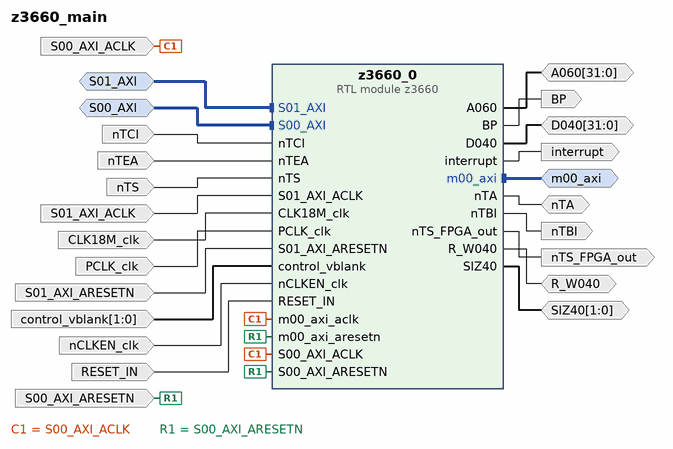
[diagram p0: block diagram of the top level]
# Vivado block design z3660_main, xc7z020clg400-1, Vivado 2023.2
create_bd_design z3660_main

create_bd_intf_port -mode Slave -vlnv xilinx.com:interface:aximm_rtl:1.0 S00_AXI
set_property -dict [list \
  CONFIG.ADDR_WIDTH 32 \
  CONFIG.ARUSER_WIDTH 0 \
  CONFIG.AWUSER_WIDTH 0 \
  CONFIG.BUSER_WIDTH 0 \
  CONFIG.DATA_WIDTH 32 \
  CONFIG.FREQ_HZ 200000000 \
  CONFIG.HAS_BRESP 1 \
  CONFIG.HAS_BURST 0 \
  CONFIG.HAS_CACHE 0 \
  CONFIG.HAS_LOCK 0 \
  CONFIG.HAS_PROT 1 \
  CONFIG.HAS_QOS 0 \
  CONFIG.HAS_REGION 0 \
  CONFIG.HAS_RRESP 1 \
  CONFIG.HAS_WSTRB 1 \
  CONFIG.ID_WIDTH 0 \
  CONFIG.MAX_BURST_LENGTH 1 \
  CONFIG.NUM_READ_OUTSTANDING 1 \
  CONFIG.NUM_READ_THREADS 4 \
  CONFIG.NUM_WRITE_OUTSTANDING 1 \
  CONFIG.NUM_WRITE_THREADS 4 \
  CONFIG.PROTOCOL AXI4LITE \
  CONFIG.READ_WRITE_MODE READ_WRITE \
  CONFIG.RUSER_BITS_PER_BYTE 0 \
  CONFIG.RUSER_WIDTH 0 \
  CONFIG.SUPPORTS_NARROW_BURST 0 \
  CONFIG.WUSER_BITS_PER_BYTE 0 \
  CONFIG.WUSER_WIDTH 0 \
] [get_bd_intf_ports S00_AXI]
create_bd_intf_port -mode Slave -vlnv xilinx.com:interface:aximm_rtl:1.0 S01_AXI
set_property -dict [list \
  CONFIG.ADDR_WIDTH 31 \
  CONFIG.ARUSER_WIDTH 0 \
  CONFIG.AWUSER_WIDTH 0 \
  CONFIG.BUSER_WIDTH 0 \
  CONFIG.DATA_WIDTH 32 \
  CONFIG.HAS_BRESP 1 \
  CONFIG.HAS_BURST 0 \
  CONFIG.HAS_CACHE 0 \
  CONFIG.HAS_LOCK 0 \
  CONFIG.HAS_PROT 1 \
  CONFIG.HAS_QOS 0 \
  CONFIG.HAS_REGION 0 \
  CONFIG.HAS_RRESP 1 \
  CONFIG.HAS_WSTRB 1 \
  CONFIG.ID_WIDTH 0 \
  CONFIG.MAX_BURST_LENGTH 1 \
  CONFIG.NUM_READ_OUTSTANDING 1 \
  CONFIG.NUM_READ_THREADS 1 \
  CONFIG.NUM_WRITE_OUTSTANDING 1 \
  CONFIG.NUM_WRITE_THREADS 1 \
  CONFIG.PHASE 0.000 \
  CONFIG.PROTOCOL AXI4LITE \
  CONFIG.READ_WRITE_MODE READ_WRITE \
  CONFIG.RUSER_BITS_PER_BYTE 0 \
  CONFIG.RUSER_WIDTH 0 \
  CONFIG.SUPPORTS_NARROW_BURST 0 \
  CONFIG.WUSER_BITS_PER_BYTE 0 \
  CONFIG.WUSER_WIDTH 0 \
] [get_bd_intf_ports S01_AXI]
create_bd_intf_port -mode Master -vlnv xilinx.com:interface:aximm_rtl:1.0 m00_axi
set_property -dict [list \
  CONFIG.ADDR_WIDTH 32 \
  CONFIG.DATA_WIDTH 32 \
  CONFIG.FREQ_HZ 200000000 \
  CONFIG.HAS_QOS 0 \
  CONFIG.HAS_REGION 0 \
  CONFIG.NUM_READ_OUTSTANDING 2 \
  CONFIG.NUM_WRITE_OUTSTANDING 2 \
  CONFIG.PROTOCOL AXI3 \
] [get_bd_intf_ports m00_axi]
create_bd_port -dir IO -from 31 -to 0 A060
create_bd_port -dir O BP
create_bd_port -dir I CLK18M_clk
create_bd_port -dir IO -from 31 -to 0 D040
create_bd_port -dir I -type clk PCLK_clk
set_property -dict {CONFIG.PHASE 30.0} [get_bd_ports PCLK_clk]
create_bd_port -dir I -type rst RESET_IN
set_property -dict {CONFIG.POLARITY ACTIVE_HIGH} [get_bd_ports RESET_IN]
create_bd_port -dir IO R_W040
create_bd_port -dir I -type clk S00_AXI_ACLK
set_property -dict [list \
  CONFIG.ASSOCIATED_BUSIF S00_AXI:m00_axi \
  CONFIG.ASSOCIATED_RESET S00_AXI_ARESETN \
  CONFIG.FREQ_HZ 200000000 \
] [get_bd_ports S00_AXI_ACLK]
create_bd_port -dir I -type rst S00_AXI_ARESETN
create_bd_port -dir I -type clk S01_AXI_ACLK
set_property -dict [list \
  CONFIG.ASSOCIATED_BUSIF S01_AXI \
  CONFIG.ASSOCIATED_RESET S01_AXI_ARESETN \
  CONFIG.PHASE 0.000 \
] [get_bd_ports S01_AXI_ACLK]
create_bd_port -dir I -type rst S01_AXI_ARESETN
create_bd_port -dir IO -from 1 -to 0 SIZ40
create_bd_port -dir I -from 1 -to 0 control_vblank
create_bd_port -dir O -type intr interrupt
create_bd_port -dir I -type clk nCLKEN_clk
set_property -dict {CONFIG.FREQ_HZ 50000000 CONFIG.PHASE 60.0} [get_bd_ports nCLKEN_clk]
create_bd_port -dir IO nTA
create_bd_port -dir O nTBI
create_bd_port -dir I nTCI
create_bd_port -dir I nTEA
create_bd_port -dir I nTS
create_bd_port -dir O nTS_FPGA_out

create_bd_cell -type module -reference z3660 z3660_0

# ---- connections ----

connect_bd_intf_net -intf_net processing_av_system_0_M_AXI [get_bd_intf_ports S01_AXI] [get_bd_intf_pins z3660_0/S01_AXI]
connect_bd_intf_net -intf_net processing_av_system_0_M_AXI1 [get_bd_intf_ports S00_AXI] [get_bd_intf_pins z3660_0/S00_AXI]
connect_bd_intf_net [get_bd_intf_ports m00_axi] [get_bd_intf_pins z3660_0/m00_axi]
connect_bd_net [get_bd_ports SIZ40] [get_bd_pins z3660_0/SIZ40]
connect_bd_net [get_bd_ports D040] [get_bd_pins z3660_0/D040]
connect_bd_net [get_bd_ports A060] [get_bd_pins z3660_0/A060]
connect_bd_net [get_bd_ports R_W040] [get_bd_pins z3660_0/R_W040]
connect_bd_net [get_bd_ports nTA] [get_bd_pins z3660_0/nTA]
connect_bd_net -net amiga_0_nTCI [get_bd_ports nTCI] [get_bd_pins z3660_0/nTCI]
connect_bd_net -net amiga_0_nTEA [get_bd_ports nTEA] [get_bd_pins z3660_0/nTEA]
connect_bd_net -net amiga_0_nTS_out [get_bd_ports nTS] [get_bd_pins z3660_0/nTS]
connect_bd_net -net processing_av_system_0_AXI_clk [get_bd_ports S01_AXI_ACLK] [get_bd_pins z3660_0/S01_AXI_ACLK]
connect_bd_net -net processing_av_system_0_CLK18M_clk [get_bd_ports CLK18M_clk] [get_bd_pins z3660_0/CLK18M_clk]
connect_bd_net -net processing_av_system_0_PCLK_reg [get_bd_ports PCLK_clk] [get_bd_pins z3660_0/PCLK_clk]
connect_bd_net -net processing_av_system_0_aresetn [get_bd_ports S01_AXI_ARESETN] [get_bd_pins z3660_0/S01_AXI_ARESETN]
connect_bd_net -net processing_av_system_0_control_vblank [get_bd_ports control_vblank] [get_bd_pins z3660_0/control_vblank]
connect_bd_net -net processing_av_system_0_nCLKEN_reg [get_bd_ports nCLKEN_clk] [get_bd_pins z3660_0/nCLKEN_clk]
connect_bd_net -net processing_av_system_0_peripheral_reset [get_bd_ports RESET_IN] [get_bd_pins z3660_0/RESET_IN]
connect_bd_net -net processing_av_system_AXI1_clk [get_bd_ports S00_AXI_ACLK] [get_bd_pins z3660_0/S00_AXI_ACLK] [get_bd_pins z3660_0/m00_axi_aclk]
connect_bd_net -net processing_av_system_aresetn1 [get_bd_ports S00_AXI_ARESETN] \
  [get_bd_pins z3660_0/S00_AXI_ARESETN] [get_bd_pins z3660_0/m00_axi_aresetn]
connect_bd_net [get_bd_pins z3660_0/BP] [get_bd_ports BP]
connect_bd_net [get_bd_pins z3660_0/interrupt] [get_bd_ports interrupt]
connect_bd_net [get_bd_pins z3660_0/nTBI] [get_bd_ports nTBI]
connect_bd_net [get_bd_pins z3660_0/nTS_FPGA_out] [get_bd_ports nTS_FPGA_out]

# ---- address map ----
assign_bd_address -offset 0x80000000 -range 512M -target_address_space [get_bd_addr_spaces S00_AXI] [get_bd_addr_segs z3660_0/S00_AXI/reg0]
assign_bd_address -offset 0x7FC70000 -range 4K -target_address_space [get_bd_addr_spaces S01_AXI] [get_bd_addr_segs z3660_0/S01_AXI/reg0]
assign_bd_address -offset 0x20000000 -range 512M -target_address_space [get_bd_addr_spaces z3660_0/m00_axi] [get_bd_addr_segs m00_axi/Reg]
assign_bd_address -offset 0x40000000 -range 1G -target_address_space [get_bd_addr_spaces z3660_0/m00_axi] [get_bd_addr_segs m00_axi/Reg]
assign_bd_address -offset 0x80000000 -range 1G -target_address_space [get_bd_addr_spaces z3660_0/m00_axi] [get_bd_addr_segs m00_axi/Reg]
assign_bd_address -offset 0xE0000000 -range 4M -target_address_space [get_bd_addr_spaces z3660_0/m00_axi] [get_bd_addr_segs m00_axi/Reg]

validate_bd_design
save_bd_design
